# Altium schematic sheet Low Distortion Oscillator.DCDC.SchDoc
size A4
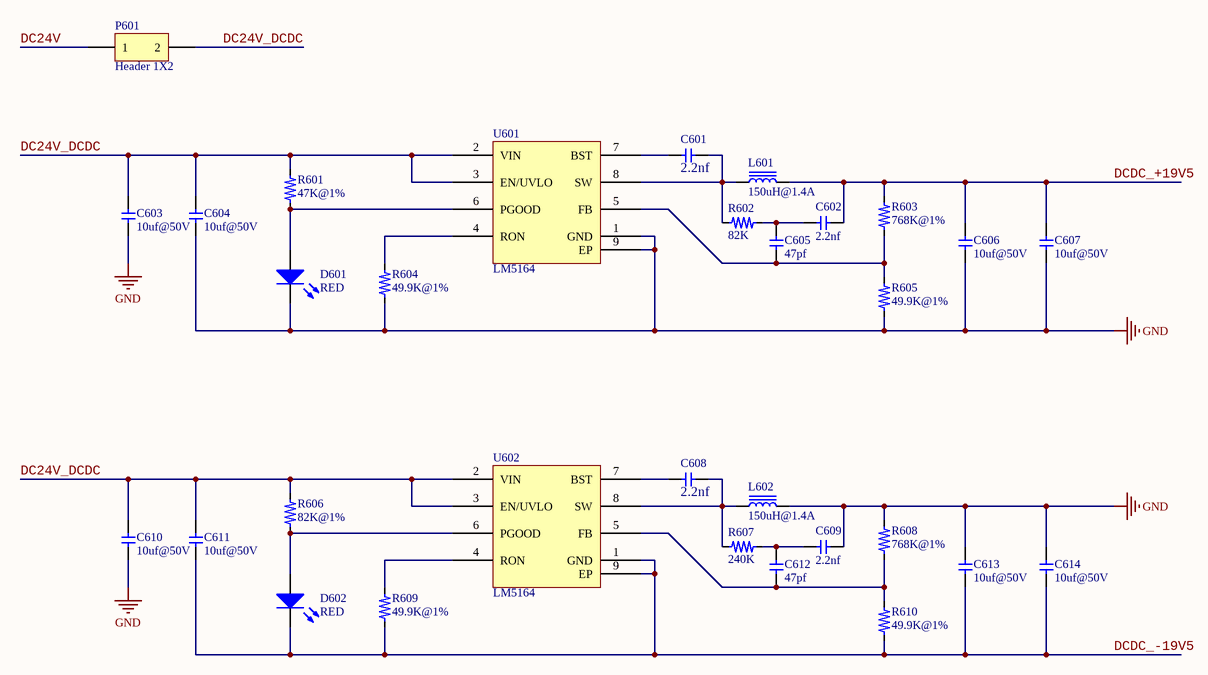
[diagram p0: Low Distortion Oscillator.DCDC.SchDoc]

## Parts
C601  value 2.2nf  [C0603]  (hidden comment: Cap)
C602  value 2.2nf  [C0603]  (hidden comment: Cap)
C603  value 10uf@50V  [C1206]  (hidden comment: Cap)
C604  value 10uf@50V  [C1206]  (hidden comment: Cap)
C605  value 47pf  [C0603]  (hidden comment: Cap)
C606  value 10uf@50V  [C1206]  (hidden comment: Cap)
C607  value 10uf@50V  [C1206]  (hidden comment: Cap)
C608  value 2.2nf  [C0603]  (hidden comment: Cap)
C609  value 2.2nf  [C0603]  (hidden comment: Cap)
C610  value 10uf@50V  [C1206]  (hidden comment: Cap)
C611  value 10uf@50V  [C1206]  (hidden comment: Cap)
C612  value 47pf  [C0603]  (hidden comment: Cap)
C613  value 10uf@50V  [C1206]  (hidden comment: Cap)
C614  value 10uf@50V  [C1206]  (hidden comment: Cap)
D601  value RED  [LED0603]  (hidden comment: LED)
D602  value RED  [LED0603]  (hidden comment: LED)
L601  value 150uH@1.4A  [L12127]  (hidden comment: Inductor Iron)
L602  value 150uH@1.4A  [L12127]  (hidden comment: Inductor Iron)
P601  Header 1X2  [HDR2X1]
R601  value 47K@1%  [R0603]  (hidden comment: Res)
R602  value 82K  [R0603]  (hidden comment: Res)
R603  value 768K@1%  [R0603]  (hidden comment: Res)
R604  value 49.9K@1%  [R0603]  (hidden comment: Res)
R605  value 49.9K@1%  [R0603]  (hidden comment: Res)
R606  value 82K@1%  [R0603]  (hidden comment: Res)
R607  value 240K  [R0603]  (hidden comment: Res)
R608  value 768K@1%  [R0603]  (hidden comment: Res)
R609  value 49.9K@1%  [R0603]  (hidden comment: Res)
R610  value 49.9K@1%  [R0603]  (hidden comment: Res)
U601  LM5164  [LM5164-SOIC8]
U602  LM5164  [LM5164-SOIC8]

## Nets
GND: C603.1 C604.1 C606.1 C607.1 C609.2 C610.1 C613.2 C614.2 D601.2(K) L602.2 R604.1 R605.1 R608.2 U601.1(GND) U601.9(EP)
DC24V: P601.1
DC24V_DCDC: C603.2 C604.2 C610.2 C611.2 P601.2 R601.2 R606.2 U601.2(VIN) U601.3(EN/UVLO) U602.2(VIN) U602.3(EN/UVLO)
DCDC_+19V5: C602.2 C606.2 C607.2 L601.2 R603.2
DCDC_-19V5: C611.1 C613.1 C614.1 D602.2(K) R609.1 R610.1 U602.1(GND) U602.9(EP)
NetC601_1: C601.1 L601.1 R602.2 U601.8(SW)
NetC601_2: C601.2 U601.7(BST)
NetC602_1: C602.1 C605.1 R602.1
NetC605_2: C605.2 R603.1 R605.2 U601.5(FB)
NetC608_1: C608.1 L602.1 R607.2 U602.8(SW)
NetC608_2: C608.2 U602.7(BST)
NetC609_1: C609.1 C612.1 R607.1
NetC612_2: C612.2 R608.1 R610.2 U602.5(FB)
NetD601_1: D601.1(A) R601.1 U601.6(PGOOD)
NetD602_1: D602.1(A) R606.1 U602.6(PGOOD)
NetR604_2: R604.2 U601.4(RON)
NetR609_2: R609.2 U602.4(RON)

## Library data of the parts
L601 L602 = Inductor Iron: Magnetic-Core Inductor
P601 = Header 1X2: Header, 1-Pin, Dual row
R601-R610 = Res: 电阻
U601 U602 = LM5164: LM5164 100-V Input, 1-A synchronous buck DC/DC converter with ultra-low IQ